# Altium schematic sheet 3EWL1-200001_04.SchDoc: Lantern MCU
size A4; Engineer: cronos; Revision: 6A1.0; SheetNumber: 4; SheetTotal: 5
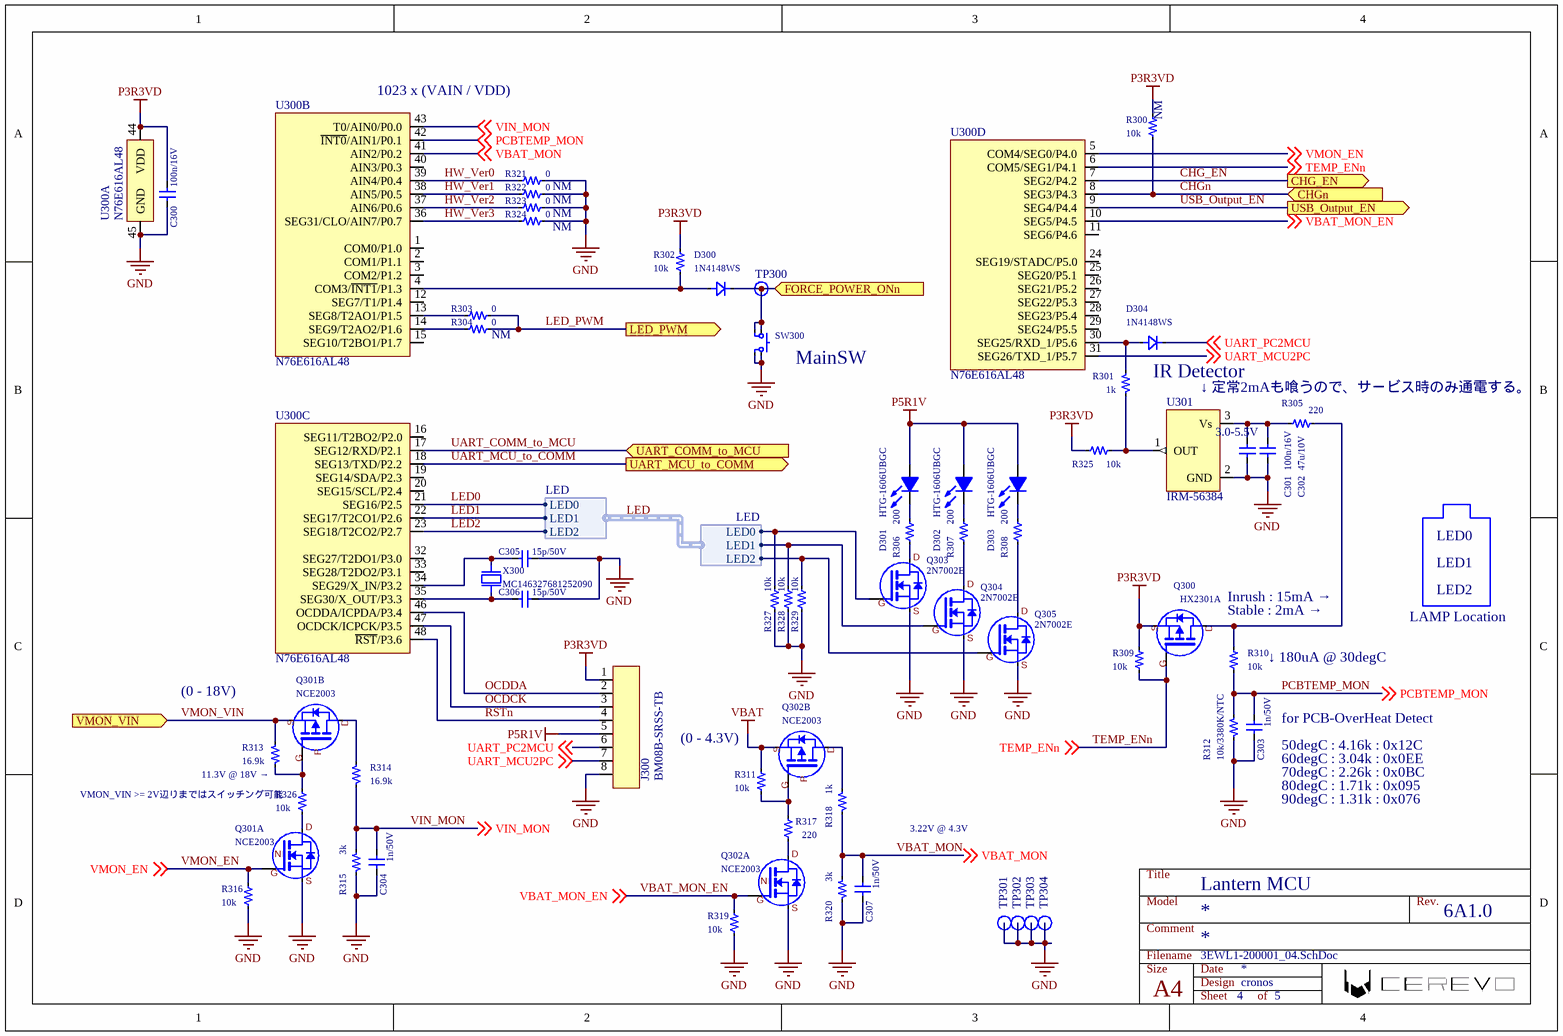
[diagram p0: 3EWL1-200001_04.SchDoc]

## Parts
C300  100n/16V  [SC2-1.00X0.50A]
C301  100n/16V  [SC2-1.00X0.50A]
C302  47u/10V  [SC2-3.20X2.50A]
C303  1n/50V  [SC2-1.00X0.50A]
C304  1n/50V  [SC2-1.00X0.50A]
C305  15p/50V  [SC2-1.00X0.50A]
C306  15p/50V  [SC2-1.00X0.50A]
C307  1n/50V  [SC2-1.00X0.50A]
D300  1N4148WS  [SD2-1.7X1.25A]
D301  HTG-1606UBGC  [HTG-1606UBGC]
D302  HTG-1606UBGC  [HTG-1606UBGC]
D303  HTG-1606UBGC  [HTG-1606UBGC]
D304  1N4148WS  [SD2-1.7X1.25A]
J300  BM08B-SRSS-TB  [BM08B-SRSS-TB]
Q300  HX2301A  [SOT23P245X120-3N]
Q301  NCE2003  [SOT23-6]  (parts A,B of 2)
Q302  NCE2003  [SOT23-6]  (parts A,B of 2)
Q303  2N7002E  [SOT23P245X120-3N]
Q304  2N7002E  [SOT23P245X120-3N]
Q305  2N7002E  [SOT23P245X120-3N]
R300  Mounting: NM  [SR2-1.00X0.50A]  (hidden comment: 10k)
R301  1k  [SR2-1.00X0.50A]
R302  10k  [SR2-1.00X0.50A]
R303  0  [SR2-1.00X0.50A]
R304  Mounting: NM  [SR2-1.00X0.50A]  (hidden comment: 0)
R305  220  [SR2-1.00X0.50A]
R306  200  [SR2-1.00X0.50A]
R307  200  [SR2-1.00X0.50A]
R308  200  [SR2-1.00X0.50A]
R309  10k  [SR2-1.00X0.50A]
R310  10k  [SR2-1.00X0.50A]
R311  10k  [SR2-1.00X0.50A]
R312  10k/3380K/NTC  [SR2-1.00X0.50A]
R313  16.9k  [SR2-1.00X0.50A]
R314  16.9k  [SR2-1.00X0.50A]
R315  3k  [SR2-1.00X0.50A]
R316  10k  [SR2-1.00X0.50A]
R317  220  [SR2-1.00X0.50A]
R318  1k  [SR2-1.00X0.50A]
R319  10k  [SR2-1.00X0.50A]
R320  3k  [SR2-1.00X0.50A]
R321  Mounting: NM  [SR2-1.00X0.50A]  (hidden comment: 0)
R322  Mounting: NM  [SR2-1.00X0.50A]  (hidden comment: 0)
R323  Mounting: NM  [SR2-1.00X0.50A]  (hidden comment: 0)
R324  Mounting: NM  [SR2-1.00X0.50A]  (hidden comment: 0)
R325  10k  [SR2-1.00X0.50A]
R326  10k  [SR2-1.00X0.50A]
R327  10k  [SR2-1.00X0.50A]
R328  10k  [SR2-1.00X0.50A]
R329  10k  [SR2-1.00X0.50A]
SW300  1825910  [1825910]  (value not drawn)
TP300  TP  [1.0mmTH]  (value not drawn)
TP301  TP  [1.0mmTH]  (value not drawn)
TP302  TP  [1.0mmTH]  (value not drawn)
TP303  TP  [1.0mmTH]  (value not drawn)
TP304  TP  [1.0mmTH]  (value not drawn)
U300  N76E616AL48  [N76E616AL48]  (parts A,B,C,D of 4)
U301  IRM-56384  [IRM-56384]
X300  MC146327681252090  [MC146327681252090]

## Ports
CHG_EN (out), CHGn (in), FORCE_POWER_ONn (in), LED_PWM (out), UART_COMM_to_MCU (in), UART_MCU_to_COMM (out), USB_Output_EN (out), VMON_VIN (in)

## Harnesses
LED: LED0, LED1, LED2

## Nets
GND: C300.2 C301.2 C302.1 C303.2 C304.2 C305.2 C306.2 C307.2 J300.8 Q301.5(N_S) Q302.5(N_S) Q303.2(S) Q304.2(S) Q305.2(S) R312.2 R315.2 R316.2 R319.2 R320.2 R321.2 R322.2 R323.2 R324.2 R327.2 R328.2 R329.2 SW300.3 SW300.4 TP301.1(TP1) TP302.1(TP1) TP303.1(TP1) TP304.1(TP1) U300.45(GND) U301.2(GND)
P3R3VD: C300.1 J300.1 Q300.2(S) R300.1 R302.1 R309.1 R325.1 U300.44(VDD)
P5R1V: D301.A D302.A D303.A J300.5
VBAT: Q302.2(P_S) R311.1
CHG_EN: U300.7(SEG2/P4.2) ; port CHG_EN
CHGn: R300.2 U300.8(SEG3/P4.3) ; port CHGn
FORCE_POWER_ONn: D300.K SW300.1 SW300.2 TP300.1(TP1) ; port FORCE_POWER_ONn
HW_Ver0: R321.1 U300.39(AIN4/P0.4)
HW_Ver1: R322.1 U300.38(AIN5/P0.5)
HW_Ver2: R323.1 U300.37(AIN6/P0.6)
HW_Ver3: R324.1 U300.36(SEG31/CLO/AIN7/P0.7)
LED0: Q303.1(G) R327.1 U300.21(SEG16/P2.5) ; harness LED.LED0  [project net LED.LED0]
LED1: Q304.1(G) R328.1 U300.22(SEG17/T2CO1/P2.6) ; harness LED.LED1  [project net LED.LED1]
LED2: Q305.1(G) R329.1 U300.23(SEG18/T2CO2/P2.7) ; harness LED.LED2  [project net LED.LED2]
LED_PWM: R303.2 R304.2 ; port LED_PWM
OCDCK: J300.3 U300.47(OCDCK/ICPCK/P3.5)
OCDDA: J300.2 U300.46(OCDDA/ICPDA/P3.4)
PCBTEMP_MON: C303.1 R310.2 R312.1 U300.42(~{INT0}/AIN1/P0.1) ; off-sheet PCBTEMP_MON
RSTn: J300.4 U300.48(~{RST}/P3.6)
TEMP_ENn: Q300.1(G) R309.2 U300.6(COM5/SEG1/P4.1) ; off-sheet TEMP_ENn
UART_COMM_to_MCU: U300.17(SEG12/RXD/P2.1) ; port UART_COMM_to_MCU
UART_MCU2PC: J300.7 U300.31(SEG26/TXD_1/P5.7) ; off-sheet UART_MCU2PC
UART_MCU_to_COMM: U300.18(SEG13/TXD/P2.2) ; port UART_MCU_to_COMM
UART_PC2MCU: D304.K J300.6 ; off-sheet UART_PC2MCU
USB_Output_EN: U300.9(SEG4/P4.4) ; port USB_Output_EN
VBAT_MON: C307.1 R318.1 R320.1 U300.41(AIN2/P0.2) ; off-sheet VBAT_MON
VBAT_MON_EN: Q302.1(N_G) R319.1 U300.10(SEG5/P4.5) ; off-sheet VBAT_MON_EN
VIN_MON: C304.1 R314.2 R315.1 U300.43(T0/AIN0/P0.0) ; off-sheet VIN_MON
VMON_EN: Q301.1(N_G) R316.1 U300.5(COM4/SEG0/P4.0) ; off-sheet VMON_EN
VMON_VIN: Q301.2(P_S) R313.1 ; port VMON_VIN
NetC301_1: C301.1 C302.2 R305.2 U301.3(Vs)
NetC305_1: C305.1 U300.34(SEG29/X_IN/P3.2) X300.2(X2)
NetC306_1: C306.1 U300.35(SEG30/X_OUT/P3.3) X300.1(X1)
NetD300_A: D300.A R302.2 U300.4(COM3/~{INT1}/P1.3)
NetD301_C: D301.C R306.2
NetD302_C: D302.C R307.2
NetD303_C: D303.C R308.2
NetD304_A: D304.A R301.2 U300.30(SEG25/RXD_1/P5.6)
NetQ300_3: Q300.3(D) R305.1 R310.1
NetQ301_3: Q301.3(P_G) R313.2 R326.1
NetQ301_4: Q301.4(P_D) R314.1
NetQ301_6: Q301.6(N_D) R326.2
NetQ302_3: Q302.3(P_G) R311.2 R317.1
NetQ302_4: Q302.4(P_D) R318.2
NetQ302_6: Q302.6(N_D) R317.2
NetQ303_3: Q303.3(D) R306.1
NetQ304_3: Q304.3(D) R307.1
NetQ305_3: Q305.3(D) R308.1
NetR301_1: R301.1 R325.2 U301.1(OUT)
NetR303_1: R303.1 U300.13(SEG8/T2AO1/P1.5)
NetR304_1: R304.1 U300.14(SEG9/T2AO2/P1.6)

Not connected (* = marked no-connect by the designer): U300 1(COM0/P1.0) 2(COM1/P1.1) 3(COM2/P1.2) 11(SEG6/P4.6) 12(SEG7/T1/P1.4) 15(SEG10/T2BO1/P1.7) 16(SEG11/T2BO2/P2.0) 19(SEG14/SDA/P2.3) 20(SEG15/SCL/P2.4) 24(SEG19/STADC/P5.0) 25(SEG20/P5.1) 26(SEG21/P5.2) 27(SEG22/P5.3) 28(SEG23/P5.4) 29(SEG24/P5.5) 32(SEG27/T2DO1/P3.0) 33(SEG28/T2DO2/P3.1) 40(AIN3/P0.3)

## Notes on the sheet
- (near U300) 1023 x (VAIN / VDD)
- (near SW300) MainSW
- IR Detector
- ↓ 定常2mAも喰うので、サービス時のみ通電する。
- LED0
- LED1
- Inrush : 15mA →
- Stable : 2mA →
- LAMP Location
- LED2
- (0 - 18V)
- (near R310) ↓ 180uA @ 30degC
- (near R313) 11.3V @ 18V →
- (0 - 4.3V)
- (near C303) for PCB-OverHeat Detect
- (near C303) 50degC : 4.16k : 0x12C
- 60degC : 3.04k : 0x0EE
- 70degC : 2.26k : 0x0BC
- 80degC : 1.71k : 0x095
- VMON_VIN >= 2V辺りまではスイッチング可能
- 3.22V @ 4.3V
- 90degC : 1.31k : 0x076
- Model
- Title
- Rev.
- Size
- Filename
- Comment
- Date
- Design
- A4
- Sheet          of
- (in symbol IRM-56384) 3.0-5.5V
- (in symbol NCE2003, part A) D; N; G; S
- (in symbol NCE2003, part B) S; D; P; G

## Library data of the parts
C300 C301 = C: 100n, 16V, X7R, 1005Size; Manufacturer: TDK; Manufacturer Part Number: C1005X5R1C104KT000N; Description 1: Capacitor (non-polar); Commodity: MLCC; Replace: OK; FirstPublished: 2012/10/14; LatestRevisionDate: *; LatestRevisionNote: *; Mounting: *; Description 2: *; Footprint(imperial): 0402; Footprint(metric): 1005; Value: 100n/16V
C302 = C: 47u/10V, X7R, 3225Size; Manufacturer: Murata; Manufacturer Part Number: GRM32ER71A476KE15L; Commodity: MLCC; Replace: OK; Mounting: *; Footprint(imperial): 1210; Footprint(metric): 3225; Value: 47u/10V
C303 C304 C307 = C: 1n/50V, C0G, 0402Size; Manufacturer: Murata; Manufacturer Part Number: GRM1555C1H102JA01D; Description 1: Capacitor (non-polar); Commodity: MLCC; Replace: OK; FirstPublished: 2012/10/14; LatestRevisionDate: *; LatestRevisionNote: *; Mounting: *; Description 2: *; Footprint(imperial): 0402; Footprint(metric): 1005; Value: 1n/50V
C305 C306 = C: 15p/50V, C0G, 0402Size; Manufacturer: YAGEO; Manufacturer Part Number: CC0201JRNPO9BN150; Description 1: Capacitor (non-polar); Commodity: MLCC; Replace: OK; FirstPublished: 2012/10/14; LatestRevisionDate: *; LatestRevisionNote: *; Mounting: *; Description 2: *; Footprint(imperial): 0402; Footprint(metric): 1005; Value: 15p/50V
D300 D304 = 1N4148WS: Diode Signal 75V 150mA 1712; Manufacturer: Fairchild Semiconductor; Description 2: 75V 150MA SOD323F; Commodity: Diode Small Dignal; Replace: OK; Manufacturer Part Number: 1N4148WS; Mounting: *; Value: 1N4148WS
D301-D303 = Diode_LED: Manufacturer: HTGLight; Commodity: LED; Replace: OK; Value: HTG-1606UBGC; Manufacturer Part Number: HTG-1606UBGC; Footprint(imperial): 0603; Footprint(metric): 1606
J300 = Con8: Manufacturer: JST; Replace: NG; Commodity: Connector; Manufacturer Part Number: BM08B-SRSS-TB; Mounting: *; Value: BM08B-SRSS-TB
Q300 = Pch_MOSFET: 20V, 2.5A, 150mohm; Manufacturer Part Number: hengjiaxing; Replace: OK; Manufacturer: HX2301A; Mounting: *; Value: HX2301A
Q301 Q302 = NCE2003: N(20V, 55mohm, Vgs(th)=1.2V ), P(-20V, 100mohm, Vgs(th)=-1V), SOT23-6; Manufacturer: ncepower; Commodity: MOSFET; Replace: OK; Mounting: *; Manufacturer Part Number: NCE2003; Value: NCE2003
Q303-Q305 = Nch_MOSFET: 60V, 300mA, 2.5V, 3ohm; Commodity: FET; Mounting: SLKORMICRO Elec; Manufacturer Part Number: 2N7002E; Manufacturer: *; Replace: *; Value: 2N7002E
R300 R302 R309-R311 R316 R319 R325-R329 = R: Manufacturer: YAGEO; Manufacturer Part Number: RC0402FR-0710KL; Description 1: Resistor; Replace: OK; FirstPublished: 2012/10/14; LatestRevisionDate: *; LatestRevisionNote: *; PackageReference: *; Description 2: *; Value: 10k; Commodity: Resistor; Footprint(imperial): 0402; Footprint(metric): 1005
  R302 R309-R311 R316 R319 R325-R329: Mounting: *
R301 R318 = R: Rsisiter 2pin; Manufacturer: Yageo; Manufacturer Part Number: RC0402FR-071KL; Description 1: Resistor; Replace: OK; FirstPublished: 2012/10/14; LatestRevisionDate: *; LatestRevisionNote: *; Mounting: *; Description 2: *; Commodity: Resistor; Footprint(imperial): 0402; Footprint(metric): 1005; Value: 1k
R303 R304 R321-R324 = R: Rsisiter 2pin; Manufacturer: YAGEO; Manufacturer Part Number: RC0402FR-07KL; Description 1: Resistor; Replace: OK; FirstPublished: 2012/10/14; LatestRevisionDate: *; LatestRevisionNote: *; PackageReference: *; Description 2: *; Value: 0; Commodity: Resistor; Footprint(imperial): 0402; Footprint(metric): 1005
  R303: Mounting: *
R305 R317 = R: 220, 1%, 1005Size; Manufacturer: YAGEO; Manufacturer Part Number: RC0402FR-07220RL; Description 1: Resistor; Replace: OK; FirstPublished: 2012/10/14; LatestRevisionDate: *; LatestRevisionNote: *; PackageReference: *; Mounting: *; Description 2: *; Value: 220; Commodity: Resistor; Footprint(imperial): 0402; Footprint(metric): 1005
R306-R308 = R: Manufacturer: YAGEO; Manufacturer Part Number: RC0402FR-07200RL; Description 1: Resistor; Replace: OK; FirstPublished: 2012/10/14; LatestRevisionDate: *; LatestRevisionNote: *; PackageReference: *; Mounting: *; Description 2: *; Value: 200; Commodity: Resistor; Footprint(imperial): 0402; Footprint(metric): 1005
R312 = R: NTC, 10k, 1%, B=3380K; Manufacturer: TDK; Manufacturer Part Number: NTCG163JF103FT1; Description 1: Resistor; Replace: OK; FirstPublished: 2012/10/14; LatestRevisionDate: *; LatestRevisionNote: *; PackageReference: *; Mounting: *; Description 2: *; Value: 10k/3380K/NTC; Commodity: Resistor; Footprint(imperial): 0402; Footprint(metric): 1005
R313 R314 = R: 16.9k, 1%, 1005Size; Manufacturer: YAGEO; Manufacturer Part Number: RC0402FR-0716K9L; Description 1: Resistor; Replace: OK; FirstPublished: 2012/10/14; LatestRevisionDate: *; LatestRevisionNote: *; PackageReference: *; Mounting: *; Description 2: *; Value: 16.9k; Commodity: Resistor; Footprint(imperial): 0402; Footprint(metric): 1005
R315 R320 = R: 3k, 1%, 1005Size; Manufacturer: YAGEO; Manufacturer Part Number: RC0402FR-073KL; Description 1: Resistor; Replace: OK; FirstPublished: 2012/10/14; LatestRevisionDate: *; LatestRevisionNote: *; PackageReference: *; Mounting: *; Description 2: *; Value: 3k; Commodity: Resistor; Footprint(imperial): 0402; Footprint(metric): 1005
SW300 = TactSW: TE SPST TactSW; Manufacturer: TE Connectivity; Value: 3-1825910-9; Replace: OK; Mounting: *; Manufacturer Part Number: 3-1825910-9; Commodity: *
TP300-TP304 = TP: Mounting: NM
U300 = N76E616AL48: 8051; Manufacturer: nuvoton; Commodity: MCU; Replace: OK; Manufacturer Part Number: N76E616AL48; Mounting: *; Value: N76E616AL48
U301 = IRM-56384: IR Receiver 38kHz, 940nm, 3.0-5.5V; Manufacturer: Everlight; Commodity: IR-Receiver; Replace: OK; Manufacturer Part Number: IRM-56384; Mounting: *; Value: IRM-56384
X300 = X'tal_Resonator: 32.768kHz 20ppm, 12.5pF; Manufacturer: JGHC; Commodity: X'tal; Replace: OK; Manufacturer Part Number: MC146327681252090; Mounting: *; Value: MC146327681252090